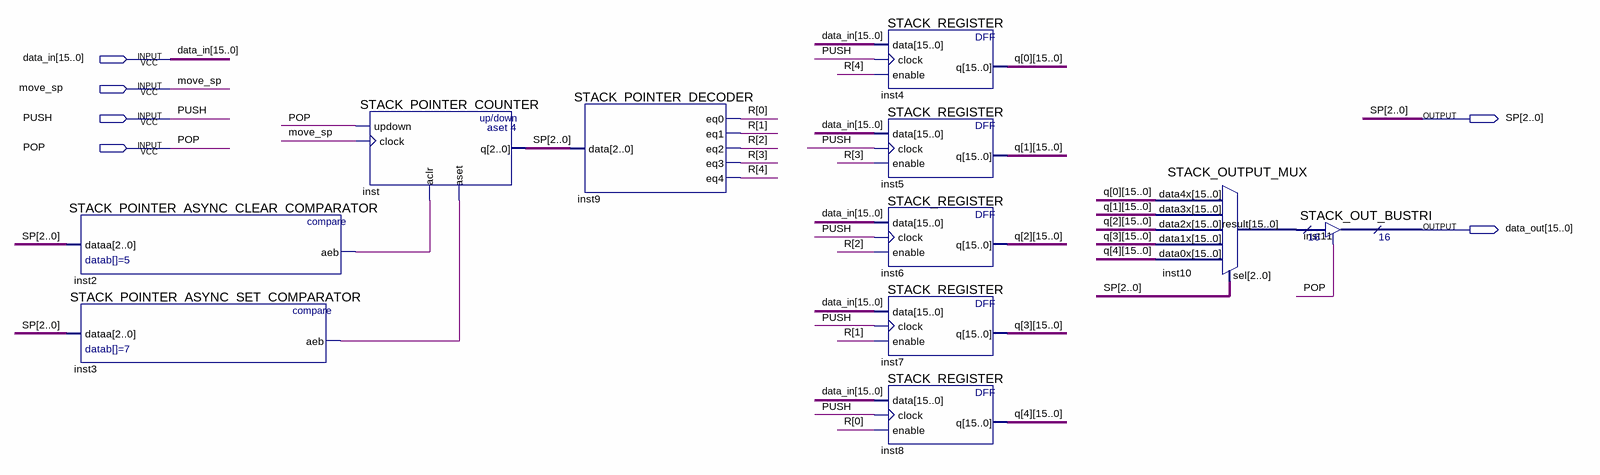
[diagram p0: schematic sheet]
// Quartus schematic STACK.bdf as structural Verilog: 11 symbols, 6 pins
module STACK (
  input  [15:0] data_in,
  input  move_sp,
  input  PUSH,
  input  POP,
  output [2:0] SP,
  output [15:0] data_out
);

  wire inst2_aeb, inst3_aeb;
  wire [4:0] R;
  wire [15:0] inst10_result, q_0, q_1, q_2, q_3, q_4;

  STACK_POINTER_ASYNC_CLEAR_COMPARATOR inst2 (.dataa(SP), .aeb(inst2_aeb));
  STACK_POINTER_ASYNC_SET_COMPARATOR inst3 (.dataa(SP), .aeb(inst3_aeb));
  STACK_POINTER_COUNTER inst (.updown(POP), .clock(move_sp), .aclr(inst2_aeb), .aset(inst3_aeb), .q(SP));
  STACK_POINTER_DECODER inst9 (.data(SP), .eq0(R[0]), .eq1(R[1]), .eq2(R[2]), .eq3(R[3]), .eq4(R[4]));
  STACK_REGISTER inst4 (.data(data_in), .clock(PUSH), .enable(R[4]), .q(q_0));
  STACK_REGISTER inst5 (.data(data_in), .clock(PUSH), .enable(R[3]), .q(q_1));
  STACK_REGISTER inst6 (.data(data_in), .clock(PUSH), .enable(R[2]), .q(q_2));
  STACK_REGISTER inst7 (.data(data_in), .clock(PUSH), .enable(R[1]), .q(q_3));
  STACK_REGISTER inst8 (.data(data_in), .clock(PUSH), .enable(R[0]), .q(q_4));
  STACK_OUTPUT_MUX inst10 (
    .data4x(q_0), .data3x(q_1), .data2x(q_2), .data1x(q_3), .data0x(q_4), .sel(SP), .result(inst10_result));
  STACK_OUT_BUSTRI inst11 (.enabledt(POP), .data(inst10_result), .tridata(data_out));
endmodule
